# Altium project uz_frontpanel_main-mini.PrjPcb
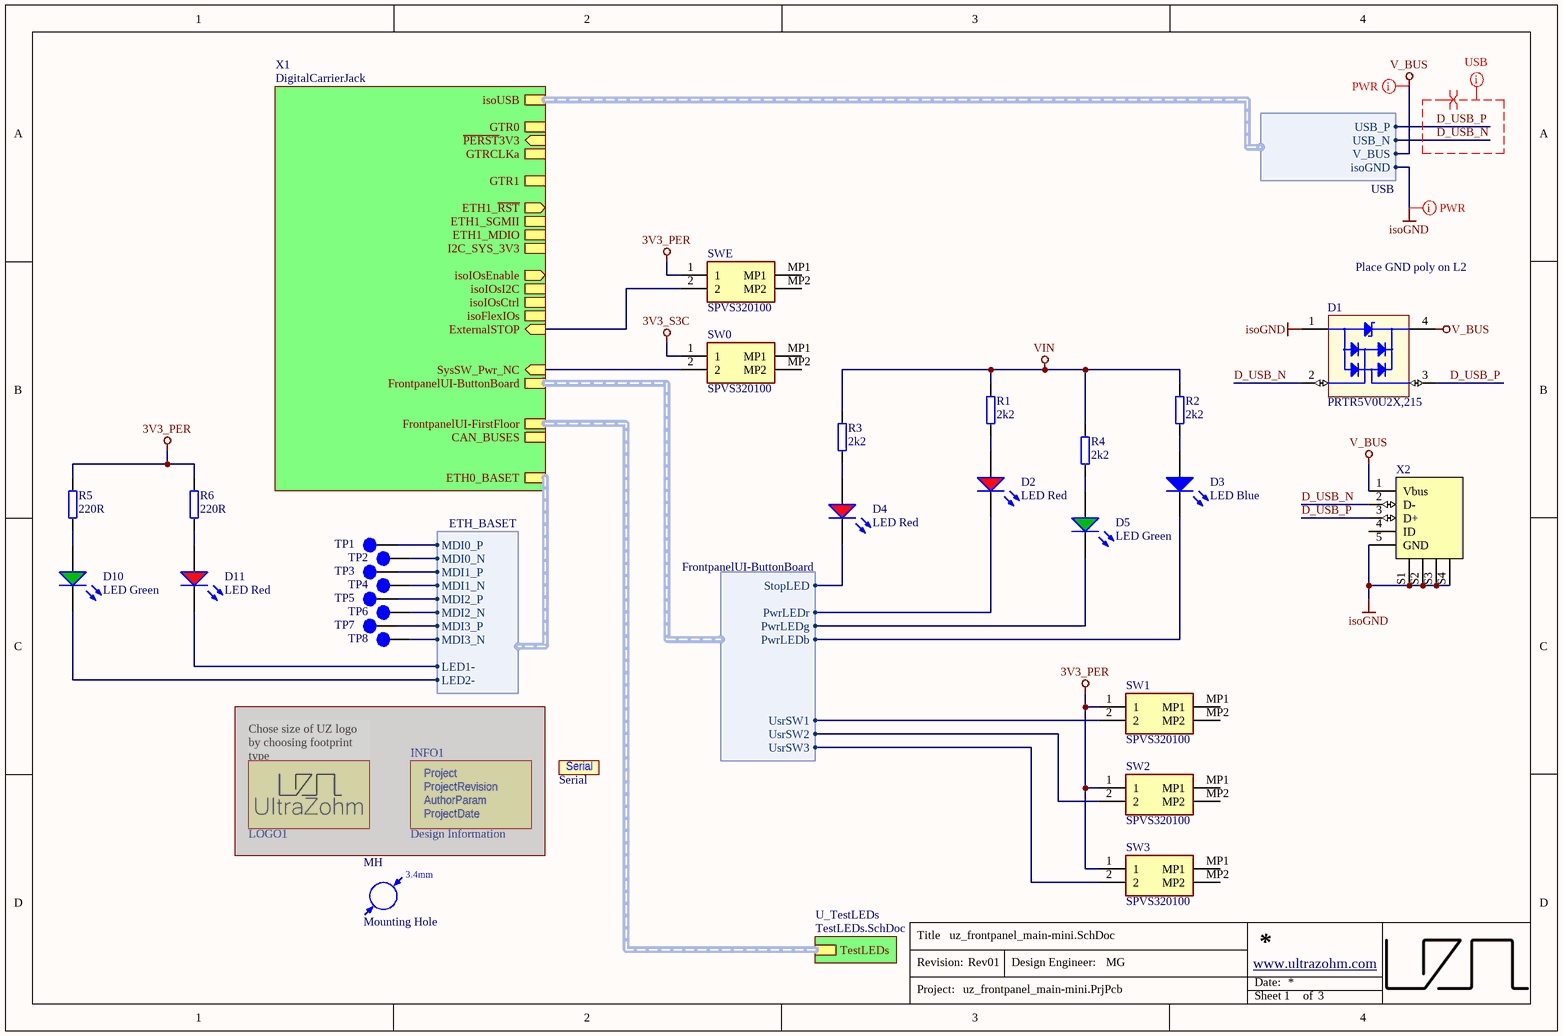
[diagram p0: uz_frontpanel_main-mini.SchDoc]
ProjectRevision: Rev01; ProjectNameCustom: uz_frontpanel_main-mini; ProjectDate: 2024.10; Project: uz_frontpanel_main-mini; FinDate: 2024.10; AuthorParam: MG; Author: MG
3 sheets, 40 parts. Net scope: hierarchical (ports join the sheet entries above them; power ports are global).
Board file: uz_frontpanel_main-mini.PcbDoc
Sheets:
  uz_frontpanel_main-mini.SchDoc
    X1 = DigitalCarrierJack.SchDoc
    U_TestLEDs = TestLEDs.SchDoc

## Sheet uz_frontpanel_main-mini.SchDoc
size A4; SheetNumber: 1; SheetTotal: 3; Website: www.ultrazohm.com

### Parts
D1  PRTR5V0U2X,215  [SOT-143B-4]
D2  LED Red  [WL-SMCW_0603]
D3  LED Blue  [WL-SMCW_0603]
D4  LED Red  [WL-SMCW_0603]
D5  LED Green  [WL-SMCW_0603]
D10  LED Green  [WL-SMCW_0603]
D11  LED Red  [WL-SMCW_0603]
INFO1  Design Information  [Design_info]  (no BOM)  (masked out: inside a compile mask, not in the netlist)
LOGO1  UZ Logo  [UZ_Logo_tiny]  (value not drawn)  (no BOM)  (masked out: inside a compile mask, not in the netlist)
MH  Mounting Hole  [MH_3.4]  (no BOM)
R1  2k2  [R_1206_TE]
R2  2k2  [R_1206_TE]
R3  2k2  [R_1206_TE]
R4  2k2  [R_1206_TE]
R5  220R  [R_0603_TE]
R6  220R  [R_0603_TE]
Serial  Serial #  [SERIAL]  (value not drawn)  (no BOM)
SW0  SPVS320100  [SPVS320100]
SW1  SPVS320100  [SPVS320100]
SW2  SPVS320100  [SPVS320100]
SW3  SPVS320100  [SPVS320100]
SWE  SPVS320100  [SPVS320100]
TP1  Testpoint 1mm  [TP_1mm]  (value not drawn)  (no BOM)
TP2  Testpoint 1mm  [TP_1mm]  (value not drawn)  (no BOM)
TP3  Testpoint 1mm  [TP_1mm]  (value not drawn)  (no BOM)
TP4  Testpoint 1mm  [TP_1mm]  (value not drawn)  (no BOM)
TP5  Testpoint 1mm  [TP_1mm]  (value not drawn)  (no BOM)
TP6  Testpoint 1mm  [TP_1mm]  (value not drawn)  (no BOM)
TP7  Testpoint 1mm  [TP_1mm]  (value not drawn)  (no BOM)
TP8  Testpoint 1mm  [TP_1mm]  (value not drawn)  (no BOM)
X2  Mini USB  [MINI_USB_5S_B _TYPE]  (value not drawn)

### Sub-sheets
U_TestLEDs = TestLEDs.SchDoc: TestLEDs (harness FrontpanelUI-FirstFloor)
X1 = DigitalCarrierJack: isoUSB (harness USB), ETH0_BASET (harness ETH_BASET), ETH1_~{RST} (out), ETH1_SGMII (harness ETH_SGMII), ETH1_MDIO (harness ETH_MDIO), GTR0 (harness GTR), ~{PERST}3V3 (in), GTRCLKa (harness MGTCLK), GTR1 (harness GTR), isoIOsEnable (out), isoIOsI2C (harness I2C), isoIOsCtrl (harness isoIOsCtrl), isoFlexIOs (harness isoFlexIOs), ExternalSTOP (in), SysSW_Pwr_NC (in), FrontpanelUI-ButtonBoard (harness FrontpanelUI-ButtonBoard), FrontpanelUI-FirstFloor (harness FrontpanelUI-FirstFloor), CAN_BUSES (harness CAN_BUSES), I2C_SYS_3V3 (harness I2C)

### Harnesses
USB: USB_P, USB_N, V_BUS, isoGND
FrontpanelUI-ButtonBoard: UsrSW1, UsrSW2, UsrSW3, StopLED, PwrLEDb, PwrLEDr, PwrLEDg
ETH_BASET: MDI0_P, MDI0_N, MDI1_P, MDI1_N, MDI2_P, MDI2_N, MDI3_P, MDI3_N, LED1-, LED2-

### Nets
3V3_PER: R5.2 R6.2 SW1.1 SW2.1 SW3.1 SWE.1
3V3_S3C: SW0.1
isoGND: D1.1(GND) X2.5(GND) X2.S1 X2.S2 X2.S3 X2.S4 ; sheet X1/isoUSB.isoGND
V_BUS: D1.4(REF) X2.1(Vbus) ; sheet X1/isoUSB.V_BUS
VIN: R1.2 R2.2 R3.2 R4.2
D_USB_N: D1.2(I/O) X2.2(D-) ; sheet X1/isoUSB.USB_N
D_USB_P: D1.3(I/O) X2.3(D+) ; sheet X1/isoUSB.USB_P
ETH0_0_N: TP2.1 ; sheet X1/ETH0_BASET.MDI0_N
ETH0_0_P: TP1.1 ; sheet X1/ETH0_BASET.MDI0_P
ETH0_1_N: TP4.1 ; sheet X1/ETH0_BASET.MDI1_N
ETH0_1_P: TP3.1 ; sheet X1/ETH0_BASET.MDI1_P
ETH0_2_N: TP6.1 ; sheet X1/ETH0_BASET.MDI2_N
ETH0_2_P: TP5.1 ; sheet X1/ETH0_BASET.MDI2_P
ETH0_3_N: TP8.1 ; sheet X1/ETH0_BASET.MDI3_N
ETH0_3_P: TP7.1 ; sheet X1/ETH0_BASET.MDI3_P
ETH0_LED1-: D11.1(K) ; sheet X1/ETH0_BASET.LED1-
ETH0_LED2-: D10.1(K) ; sheet X1/ETH0_BASET.LED2-
ExternalSTOP: SWE.2 ; sheet X1/ExternalSTOP
FrontpanelUI-BB.PwrLEDb: D3.1(K) ; sheet X1/FrontpanelUI-ButtonBoard.PwrLEDb
FrontpanelUI-BB.PwrLEDg: D5.1(K) ; sheet X1/FrontpanelUI-ButtonBoard.PwrLEDg
FrontpanelUI-BB.PwrLEDr: D2.1(K) ; sheet X1/FrontpanelUI-ButtonBoard.PwrLEDr
FrontpanelUI-BB.StopLED: D4.1(K) ; sheet X1/FrontpanelUI-ButtonBoard.StopLED
FrontpanelUI-BB.UsrSW1: SW1.2 ; sheet X1/FrontpanelUI-ButtonBoard.UsrSW1
FrontpanelUI-BB.UsrSW2: SW2.2 ; sheet X1/FrontpanelUI-ButtonBoard.UsrSW2
FrontpanelUI-BB.UsrSW3: SW3.2 ; sheet X1/FrontpanelUI-ButtonBoard.UsrSW3
NetD2_2: D2.2(A) R1.1
NetD3_2: D3.2(A) R2.1
NetD4_2: D4.2(A) R3.1
NetD5_2: D5.2(A) R4.1
NetD10_2: D10.2(A) R5.1
NetD11_2: D11.2(A) R6.1
NetSW0_2: SW0.2 ; sheet X1/SysSW_Pwr_NC

Not connected (* = marked no-connect by the designer): SW0 MP1 MP2; SW1 MP1 MP2; SW2 MP1 MP2; SW3 MP1 MP2; SWE MP1 MP2; X2 4(ID)

### Buses and harness runs
harness sheet U_TestLEDs/TestLEDs = sheet X1/FrontpanelUI-FirstFloor

### Layout directives
differential pair: D_USB_N, D_USB_P
net class USB: D_USB_N, D_USB_P
net class PWR: isoGND, V_BUS

### Notes on the sheet
- Place GND poly on L2
- (near LOGO1) Chose size of UZ logo by choosing footprint type
- Title
- Revision:
- Design Engineer:
- Date:
- Project:
- Sheet
- of
- (in symbol Design Information) Project; ProjectRevision; AuthorParam; ProjectDate
- (in symbol Mounting Hole) 3.4mm

### Library data of the parts
D1 = PRTR5V0U2X,215: ESD Suppressors / TVS Diodes PRTR5V0U2X/SOT143/SOT4; Manufacturer: Nexperia; Type: TVS-Diode; Created from: AGeiger; Manufacturer Part Number: PRTR5V0U2X,215; PartID: 10; Created On: 26.11.2023 17:14:11; ComponentLink1Description: Datasheet; ComponentLink1URL: https://www.mouser.de/datasheet/2/916/PRTR5V0U2X-2938759.pdf; Component Type: TVS Diode, ESD; Device Package: SOT-143B-4; Last Updated: 26.11.2023 17:16:37; Mounting Type: SMD; Operating Temperature: -40 to 85 °C; Supplier 1: Mouser; Supplier Part Number 1: 771-PRTR5V0U2X-T/R; Supplier 2: LCSC; Supplier Part Number 2: C12333; Value: PRTR5V0U2X,215; Live Cycle Status: 1; LCSC Part Number: C12333
D2 D4 D11 = UZgen_LED_0603_Red: Standard LEDs - SMD 0603 red; Manufacturer: UZgen; Created from: UZgenTool; Manufacturer Part Number: UZgen_LED_0603_Red; PartID: 22; Created On: 09/09/2024 10:45:01; ComponentLink1Description: N/A; ComponentLink1URL: N/A; Component Type: LED Diode; Device Package: 0603; Last Updated: 09/09/2024 10:45:01; Mounting Type: SMD; Supplier 1: LCSC; Supplier Part Number 1: =LCSC Part Number; Type: Standard; Value: LED Red; Live Cycle Status: 1; Stock number: not stored; Color: red
D3 = UZgen_LED_0603_Blue: Standard LEDs - SMD 0603 blue; Manufacturer: UZgen; Created from: UZgenTool; Manufacturer Part Number: UZgen_LED_0603_Blue; PartID: 20; Created On: 09/09/2024 10:45:01; ComponentLink1Description: N/A; ComponentLink1URL: N/A; Component Type: LED Diode; Device Package: 0603; Last Updated: 09/09/2024 10:45:01; Mounting Type: SMD; Supplier 1: LCSC; Supplier Part Number 1: =LCSC Part Number; Type: Standard; Value: LED Blue; Live Cycle Status: 1; Stock number: not stored; Color: blue
D5 D10 = UZgen_LED_0603_Green: Standard LEDs - SMD 0603 green; Manufacturer: UZgen; Created from: UZgenTool; Manufacturer Part Number: UZgen_LED_0603_Green; PartID: 21; Created On: 09/09/2024 10:45:01; ComponentLink1Description: N/A; ComponentLink1URL: N/A; Component Type: LED Diode; Device Package: 0603; Last Updated: 09/09/2024 10:45:01; Mounting Type: SMD; Supplier 1: LCSC; Supplier Part Number 1: =LCSC Part Number; Type: Standard; Value: LED Green; Live Cycle Status: 1; Stock number: not stored; Color: green
INFO1 = Design Information: Manufacturer: UltraZohm; Created from: MGremer; Manufacturer Part Number: Design Information; PartID: 12; Created On: 03.11.2021 09:04:23; ComponentLink1Description: https://docs.ultrazohm.com/; ComponentLink1URL: homepage; Component Type: Design Information; Last Updated: 03.11.2021 09:28:34; Supplier 1: -; Supplier Part Number 1: -; Type: Design Information; Value: Design Information; Live Cycle Status: 1
LOGO1 = 1: Official Project Logo of the UltraZohm; Manufacturer: PCB Manufacturer; Manufacturer Part Number: UltraZohm Logo; Created from: T. Wendt; PartID: 1; Created On: 19.02.2021 16:55:56; ComponentLink1Description: Homepage; ComponentLink1URL: https://ultrazohm.com; Component Type: Logo; Last Updated: 02.03.2021 14:31:24; Type: Standard (No BOM); Live Cycle Status: 1
MH = Mounting Hole: Created from: MHlatky; Manufacturer Part Number: Mounting Hole; PartID: 16; Created On: 26/01/2021 09:19:51; ComponentLink1Description: Datasheet; Component Type: Mounting Hole; Device Package: -; Last Updated: 21/03/2022 23:05:12; Manufacturer: Mounting Hole; Supplier 1: Mounting Hole; Supplier Part Number 1: Mounting Hole; Type: Mounting Hole; Value: Mounting Hole; Live Cycle Status: 1; Stock number: not stored
R1-R4 = UZgen_R_1206_2k2: Generic resistor; Manufacturer: UZgen; Tolerance: 1 %; Created from: UZgenTool; Manufacturer Part Number: UZgen_R_1206_2k2; PartID: 516; Created On: 02/07/2024 17:29:56; Value: 2k2; Device Package: 1206; Mounting Type: SMD; Last Updated: 02/07/2024 17:29:56
R5 R6 = UZgen_R_0603_220R: Generic resistor; Manufacturer: UZgen; Tolerance: 1 %; Created from: UZgenTool; Manufacturer Part Number: UZgen_R_0603_220R; PartID: 205; Created On: 02/07/2024 17:29:49; Value: 220R; Device Package: 0603; Mounting Type: SMD; Last Updated: 02/07/2024 17:29:49
Serial = 6: Field to put in a serial number; Manufacturer: PCB Manufacturer; Created from: T. Wendt; PartID: 6; Created On: 02/03/2021 14:31:24; Component Type: Serial Number; Last Updated: 02/03/2021 14:31:24; Manufacturer Part Number: Serial Number; Type: Standard (No BOM); Live Cycle Status: 1
SW0-SW3 SWE = SPVS320100: Detector Switches 1 mAmp at 5 Volts 0.35 N; Manufacturer: Alps Alpine; Created from: FRosner; Manufacturer Part Number: SPVS320100; PartID: 45; Created On: 19/09/2024 10:04:55; ComponentLink1Description: Datasheet; ComponentLink1URL: https://www.mouser.de/datasheet/2/15/SPVS-1370820.pdf; Component Type: Detector Switches; Device Package: THT; Last Updated: 19/09/2024 10:04:55; Mounting Type: SMD; Supplier 1: Mouser; Supplier Part Number 1: 688-SPVS320100; Supplier 2: LCSC; Supplier Part Number 2: C160855; Type: Detector Switch; Value: SPVS320100; Live Cycle Status: 1; LCSC Part Number: C160855; Stock number: not stored
TP1-TP8 = NULL: Manufacturer Part Number: NULL; Created from: AGeiger; Created: 2018_06_25_AGeiger; Value: Testpoint 1mm; PartID: 9; Created On: 20/09/2022 13:14:57; Component Type: Testpoint; Last Updated: 20/09/2022 13:15:39; Manufacturer: NULL; Supplier 1: NULL; Supplier Part Number 1: NULL; Type: Testpoint; Live Cycle Status: 1
X2 = MINI 5PTP: 1A 1 Surface Mount 5P Female -30℃~+80℃ SMD USB Connectors ROHS; Manufacturer: SHOU HAN; Created from: AGeiger; Manufacturer Part Number: MINI 5PTP; PartID: 24; Created On: 26/11/2023 17:41:34; ComponentLink1Description: Datasheet; ComponentLink1URL: https://datasheet.lcsc.com/lcsc/2101221940_SHOU-HAN-MINI-5PTP_C2681563.pdf; Last Updated: 26/11/2023 17:41:34; Mounting Type: SMD; Operating Temperature: -30 °C to +80 °C; Series: Mini USB; Supplier 1: LCSC; Supplier Part Number 1: C2681563; Value: Mini USB; LCSC Part Number: C2681563

## Sheet DigitalCarrierJack.SchDoc
size A4; Organization: UltraZohm; SheetNumber: 2; SheetTotal: 15
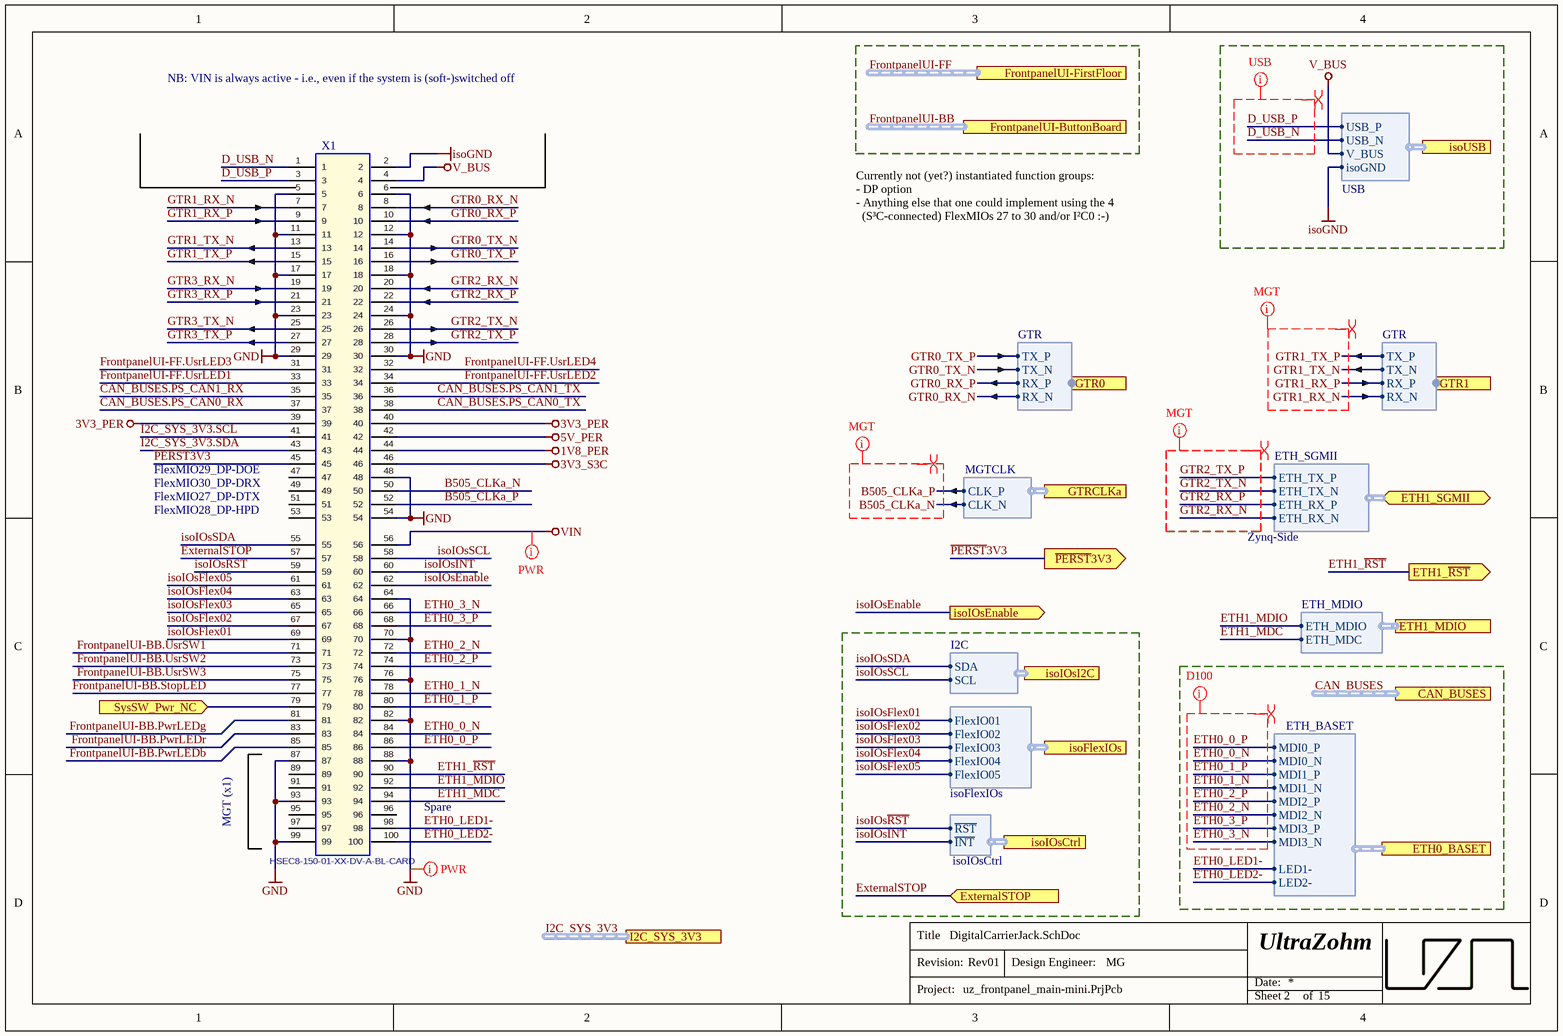
[diagram p1: DigitalCarrierJack.SchDoc]

### Parts
X1  HSEC8-150-01-XX-DV-A-BL-CARD  [HSEC8-150-01-XX-DV-A-BL-CARD]  (no BOM)

### Ports
CAN_BUSES (harness CAN_BUSES), ETH0_BASET (harness ETH_BASET), ETH1_MDIO (harness ETH_MDIO), ETH1_SGMII (bidir, harness ETH_SGMII), ETH1_~{RST} (out), ExternalSTOP (in), FrontpanelUI-ButtonBoard (harness FrontpanelUI-ButtonBoard), FrontpanelUI-FirstFloor (harness FrontpanelUI-FirstFloor), GTR0 (harness GTR), GTR1 (harness GTR), GTRCLKa (harness MGTCLK), I2C_SYS_3V3 (harness I2C), isoFlexIOs (harness isoFlexIOs), isoIOsCtrl (harness isoIOsCtrl), isoIOsEnable (out), isoIOsI2C (harness I2C), isoUSB (harness USB), SysSW_Pwr_NC (in), ~{PERST}3V3 (out)

### Harnesses
USB: USB_P, USB_N, V_BUS, isoGND
ETH_BASET: MDI0_P, MDI0_N, MDI1_P, MDI1_N, MDI2_P, MDI2_N, MDI3_P, MDI3_N, LED1-, LED2-
ETH_SGMII: ETH_RX_N, ETH_RX_P, ETH_TX_N, ETH_TX_P
ETH_MDIO: ETH_MDC, ETH_MDIO
I2C: SCL, SDA
isoFlexIOs: FlexIO01, FlexIO02, FlexIO03, FlexIO04, FlexIO05
isoIOsCtrl: ~{RST}, ~{INT}
GTR: RX_N, RX_P, TX_N, TX_P
MGTCLK: CLK_N, CLK_P

### Nets
1V8_PER: X1.44
3V3_PER: X1.39 X1.40
3V3_S3C: X1.46
5V_PER: X1.42
GND: X1.5 X1.6 X1.11 X1.12 X1.17 X1.18 X1.23 X1.24 X1.29 X1.30 X1.48 X1.54 X1.64 X1.70 X1.76 X1.82 X1.87 X1.88 X1.93 X1.99
isoGND: X1.2 ; port isoUSB.isoGND
V_BUS: X1.4 ; port isoUSB.V_BUS
VIN: X1.56
B505_CLKa_N: X1.50 ; port GTRCLKa.CLK_N
B505_CLKa_P: X1.52 ; port GTRCLKa.CLK_P
CAN_BUSES.PS_CAN0_RX: X1.37
CAN_BUSES.PS_CAN0_TX: X1.38
CAN_BUSES.PS_CAN1_RX: X1.35
CAN_BUSES.PS_CAN1_TX: X1.36
D_USB_N: X1.1 ; port isoUSB.USB_N
D_USB_P: X1.3 ; port isoUSB.USB_P
ETH0_0_N: X1.84 ; port ETH0_BASET.MDI0_N
ETH0_0_P: X1.86 ; port ETH0_BASET.MDI0_P
ETH0_1_N: X1.78 ; port ETH0_BASET.MDI1_N
ETH0_1_P: X1.80 ; port ETH0_BASET.MDI1_P
ETH0_2_N: X1.72 ; port ETH0_BASET.MDI2_N
ETH0_2_P: X1.74 ; port ETH0_BASET.MDI2_P
ETH0_3_N: X1.66 ; port ETH0_BASET.MDI3_N
ETH0_3_P: X1.68 ; port ETH0_BASET.MDI3_P
ETH0_LED1-: X1.98 ; port ETH0_BASET.LED1-
ETH0_LED2-: X1.100 ; port ETH0_BASET.LED2-
ETH1_MDC: X1.94 ; port ETH1_MDIO.ETH_MDC
ETH1_MDIO: X1.92 ; port ETH1_MDIO.ETH_MDIO
ETH1_~{RST}: X1.90 ; port ETH1_~{RST}
ExternalSTOP: X1.57 ; port ExternalSTOP
FrontpanelUI-BB.PwrLEDb: X1.85
FrontpanelUI-BB.PwrLEDg: X1.81
FrontpanelUI-BB.PwrLEDr: X1.83
FrontpanelUI-BB.StopLED: X1.77
FrontpanelUI-BB.UsrSW1: X1.71
FrontpanelUI-BB.UsrSW2: X1.73
FrontpanelUI-BB.UsrSW3: X1.75
FrontpanelUI-FF.UsrLED1: X1.33
FrontpanelUI-FF.UsrLED2: X1.34
FrontpanelUI-FF.UsrLED3: X1.31
FrontpanelUI-FF.UsrLED4: X1.32
GTR0_RX_N: X1.8 ; port GTR0.RX_N
GTR0_RX_P: X1.10 ; port GTR0.RX_P
GTR0_TX_N: X1.14 ; port GTR0.TX_N
GTR0_TX_P: X1.16 ; port GTR0.TX_P
GTR1_RX_N: X1.7 ; port GTR1.RX_N
GTR1_RX_P: X1.9 ; port GTR1.RX_P
GTR1_TX_N: X1.13 ; port GTR1.TX_N
GTR1_TX_P: X1.15 ; port GTR1.TX_P
GTR2_RX_N: X1.20 ; port ETH1_SGMII.ETH_RX_N
GTR2_RX_P: X1.22 ; port ETH1_SGMII.ETH_RX_P
GTR2_TX_N: X1.26 ; port ETH1_SGMII.ETH_TX_N
GTR2_TX_P: X1.28 ; port ETH1_SGMII.ETH_TX_P
GTR3_RX_N: X1.19
GTR3_RX_P: X1.21
GTR3_TX_N: X1.25
GTR3_TX_P: X1.27
I2C_SYS_3V3.SCL: X1.41
I2C_SYS_3V3.SDA: X1.43
isoIOsEnable: X1.62 ; port isoIOsEnable
isoIOsFlex01: X1.69 ; port isoFlexIOs.FlexIO01
isoIOsFlex02: X1.67 ; port isoFlexIOs.FlexIO02
isoIOsFlex03: X1.65 ; port isoFlexIOs.FlexIO03
isoIOsFlex04: X1.63 ; port isoFlexIOs.FlexIO04
isoIOsFlex05: X1.61 ; port isoFlexIOs.FlexIO05
isoIOs~{INT}: X1.60 ; port isoIOsCtrl.~{INT}
isoIOs~{RST}: X1.59 ; port isoIOsCtrl.~{RST}
isoIOsSCL: X1.58 ; port isoIOsI2C.SCL
isoIOsSDA: X1.55 ; port isoIOsI2C.SDA
~{PERST}3V3: X1.45 ; port ~{PERST}3V3
NetSW0_2: X1.79 ; port SysSW_Pwr_NC

Not connected (* = marked no-connect by the designer): X1 47 49 51 53 89 91 95 96 97

### Buses and harness runs
harness CAN_BUSES = port CAN_BUSES
harness FrontpanelUI-BB = port FrontpanelUI-ButtonBoard
harness FrontpanelUI-FF = port FrontpanelUI-FirstFloor
harness I2C_SYS_3V3 = port I2C_SYS_3V3

### Layout directives
differential pair: B505_CLKa_N, B505_CLKa_P, D_USB_N, D_USB_P, ETH0_0_N, ETH0_0_P, ETH0_1_N, ETH0_1_P, ETH0_2_N, ETH0_2_P, ETH0_3_N, ETH0_3_P, GTR1_RX_N, GTR1_RX_P, GTR1_TX_N, GTR1_TX_P, GTR2_RX_N, GTR2_RX_P, GTR2_TX_N, GTR2_TX_P
net class USB: D_USB_N, D_USB_P
net class D100: ETH0_0_N, ETH0_0_P, ETH0_1_N, ETH0_1_P, ETH0_2_N, ETH0_2_P, ETH0_3_N, ETH0_3_P
net class MGT: B505_CLKa_N, B505_CLKa_P, GTR1_RX_N, GTR1_RX_P, GTR1_TX_N, GTR1_TX_P, GTR2_RX_N, GTR2_RX_P, GTR2_TX_N, GTR2_TX_P
net class PWR: GND, VIN

### Notes on the sheet
- NB: VIN is always active - i.e., even if the system is (soft-)switched off
- Currently not (yet?) instantiated function groups:
  - DP option
  - Anything else that one could implement using the 4
  (S³C-connected) FlexMIOs 27 to 30 and/or I²C0 :-)
- FlexMIO28_DP-HPD
- FlexMIO27_DP-DTX
- FlexMIO30_DP-DRX
- FlexMIO29_DP-DOE
- Zynq-Side
- MGT (x1)
- (near X1) Spare
- Title
- Revision:
- Design Engineer:
- Date:
- Project:
- Sheet
- of

### Library data of the parts
X1 = HSEC8-150-01-XX-DV-A-BL-CARD: Mating Card Layout for HSEC8-150-01-XX-DV-A-BL; Manufacturer: SAMTEC; Created: 2018_04_23_AGeiger; Value: HSEC8-150-01-XX-DV-A-BL-CARD

## Sheet TestLEDs.SchDoc
size A4
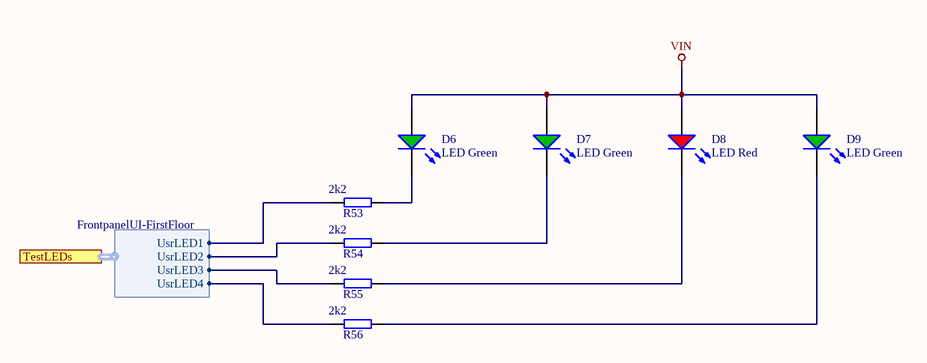
[diagram p2: TestLEDs.SchDoc]

### Parts
D6  LED Green  [WL-SMCW_0603]
D7  LED Green  [WL-SMCW_0603]
D8  LED Red  [WL-SMCW_0603]
D9  LED Green  [WL-SMCW_0603]
R53  2k2  [R_1206_TE]
R54  2k2  [R_1206_TE]
R55  2k2  [R_1206_TE]
R56  2k2  [R_1206_TE]

### Ports
TestLEDs (harness FrontpanelUI-FirstFloor)

### Harnesses
FrontpanelUI-FirstFloor: UsrLED1, UsrLED2, UsrLED3, UsrLED4

### Nets
VIN: D6.2(A) D7.2(A) D8.2(A) D9.2(A)
FrontpanelUI-FF.UsrLED1: R53.1 ; port TestLEDs.UsrLED1
FrontpanelUI-FF.UsrLED2: R54.1 ; port TestLEDs.UsrLED2
FrontpanelUI-FF.UsrLED3: R55.1 ; port TestLEDs.UsrLED3
FrontpanelUI-FF.UsrLED4: R56.1 ; port TestLEDs.UsrLED4
NetD6_1: D6.1(K) R53.2
NetD7_1: D7.1(K) R54.2
NetD8_1: D8.1(K) R55.2
NetD9_1: D9.1(K) R56.2

### Notes on the sheet
- Title
- Revision:
- Design Engineer:
- Date:
- Project:
- Sheet
- of

### Library data of the parts
D6 D7 D9 = UZgen_LED_0603_Green: as D5 on sheet uz_frontpanel_main-mini; Manufacturer Part Number: UZgen_LED_0603_Green; PartID: 21; Created On: 09/09/2024 10:45:01; ComponentLink1Description: N/A; ComponentLink1URL: N/A; Component Type: LED Diode; Device Package: 0603; Last Updated: 09/09/2024 10:45:01; Mounting Type: SMD; Supplier 1: LCSC; Supplier Part Number 1: =LCSC Part Number; Type: Standard; Live Cycle Status: 1; Stock number: not stored; Color: green; Value: LED Green
D8 = UZgen_LED_0603_Red: as D2 on sheet uz_frontpanel_main-mini; Manufacturer Part Number: UZgen_LED_0603_Red; PartID: 22; Created On: 09/09/2024 10:45:01; ComponentLink1Description: N/A; ComponentLink1URL: N/A; Component Type: LED Diode; Device Package: 0603; Last Updated: 09/09/2024 10:45:01; Mounting Type: SMD; Supplier 1: LCSC; Supplier Part Number 1: =LCSC Part Number; Type: Standard; Live Cycle Status: 1; Stock number: not stored; Color: red; Value: LED Red
R53-R56 = UZgen_R_1206_2k2: as R1 on sheet uz_frontpanel_main-mini; Manufacturer Part Number: UZgen_R_1206_2k2; PartID: 516; Created On: 02/07/2024 17:29:56; Value: 2k2; Device Package: 1206; Mounting Type: SMD; Last Updated: 02/07/2024 17:29:56

## Nets that join several sheets
3V3_PER: uz_frontpanel_main-mini (6 pins), DigitalCarrierJack (X1.39 X1.40)
3V3_S3C: uz_frontpanel_main-mini (SW0.1), DigitalCarrierJack (X1.46)
isoGND: uz_frontpanel_main-mini (6 pins), DigitalCarrierJack (X1.2)
V_BUS: uz_frontpanel_main-mini (D1.4 X2.1), DigitalCarrierJack (X1.4)
VIN: uz_frontpanel_main-mini (R1.2 R2.2 R3.2 R4.2), DigitalCarrierJack (X1.56), TestLEDs (D6.2 D7.2 D8.2 D9.2)
D_USB_N: uz_frontpanel_main-mini (D1.2 X2.2), DigitalCarrierJack (X1.1)
D_USB_P: uz_frontpanel_main-mini (D1.3 X2.3), DigitalCarrierJack (X1.3)
ETH0_0_N: uz_frontpanel_main-mini (TP2.1), DigitalCarrierJack (X1.84)
ETH0_0_P: uz_frontpanel_main-mini (TP1.1), DigitalCarrierJack (X1.86)
ETH0_1_N: uz_frontpanel_main-mini (TP4.1), DigitalCarrierJack (X1.78)
ETH0_1_P: uz_frontpanel_main-mini (TP3.1), DigitalCarrierJack (X1.80)
ETH0_2_N: uz_frontpanel_main-mini (TP6.1), DigitalCarrierJack (X1.72)
ETH0_2_P: uz_frontpanel_main-mini (TP5.1), DigitalCarrierJack (X1.74)
ETH0_3_N: uz_frontpanel_main-mini (TP8.1), DigitalCarrierJack (X1.66)
ETH0_3_P: uz_frontpanel_main-mini (TP7.1), DigitalCarrierJack (X1.68)
ETH0_LED1-: uz_frontpanel_main-mini (D11.1), DigitalCarrierJack (X1.98)
ETH0_LED2-: uz_frontpanel_main-mini (D10.1), DigitalCarrierJack (X1.100)
ExternalSTOP: uz_frontpanel_main-mini (SWE.2), DigitalCarrierJack (X1.57)
NetSW0_2: uz_frontpanel_main-mini (SW0.2), DigitalCarrierJack (X1.79)

## Assembly variants
Rev01Batch00: all parts fitted